# Altium schematic sheet 超声波传感器.SchDoc
size A4
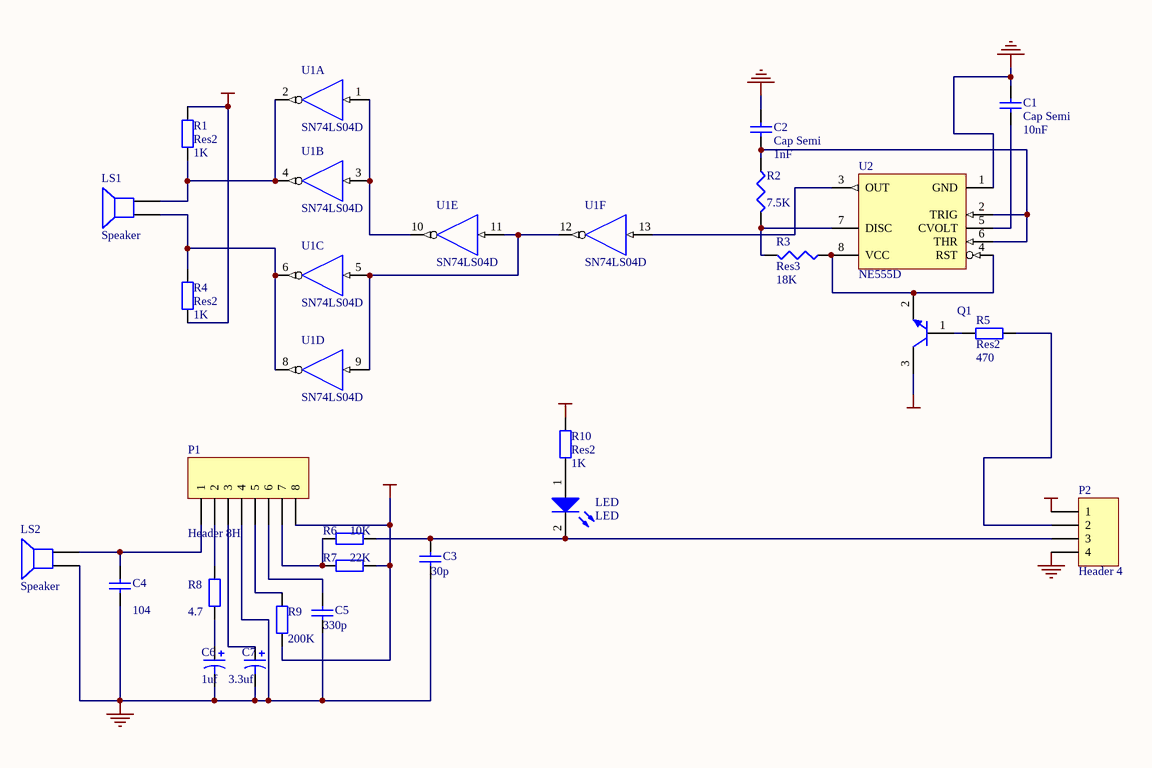
[diagram p0: 超声波传感器.SchDoc]

## Parts
C1  Cap Semi  value 10nF  [CPDR]
C2  Cap Semi  value 1nF  [CPDR]
C3  value 30p  [CPDR]  (hidden comment: Cap Semi)
C4  value 104  [CPDR]  (hidden comment: Cap Semi)
C5  value 330p  [CPDR]  (hidden comment: Cap Semi)
C6  value 1uf  [C-DJ-4]  (hidden comment: Cap Pol3)
C7  value 3.3uf  [C-DJ-4]  (hidden comment: Cap Pol3)
LED  LED  [CPDR]
LS1  Speaker  [CSB]
LS2  Speaker  [CSB]
P1  Header 8H  [HDR-8]
P2  Header 4  [HDR1X4]
Q1  (no value)  [BCY-W3/E4]
R1  Res2  value 1K  [RSE]
R2  value 7.5K  [RSE]  (hidden comment: Res3)
R3  Res3  value 18K  [RSE]
R4  Res2  value 1K  [RSE]
R5  Res2  value 470  [RSE]
R6  value 10K  [RSE]  (hidden comment: Res2)
R7  value 22K  [RSE]  (hidden comment: Res2)
R8  value 4.7  [RSE]  (hidden comment: Res2)
R9  value 200K  [RSE]  (hidden comment: Res2)
R10  Res2  value 1K  [RSE]
U1  SN74LS04D  [DIP14]  (parts A,B,C,D,E,F of 6)
U2  NE555D  [DIP8]

## Nets
GND: C1.1 C2.1 C3.2 C4.2 C5.2 C6.2 C7.2 LS2.1 P1.4 P2.4 U1.7(GND) U2.1(GND)
VCC: P1.8 P2.1 Q1.3(C) R1.2 R4.1 R7.2 R9.1 R10.2 U1.14(VCC)
NetC1_2: C1.2 U2.5(CVOLT)
NetC2_2: C2.2 R2.1 U2.2(TRIG) U2.6(THR)
NetC3_1: C3.1 LED.2(K) P2.3 R6.1
NetC4_1: C4.1 LS2.2 P1.1
NetC5_1: C5.1 P1.6
NetC6_1: C6.1 R8.1
NetC7_1: C7.1 P1.3
NetLED_1: LED.1(A) R10.1
NetLS1_1: LS1.1 R4.2 U1.6(Y) U1.8(Y)
NetLS1_2: LS1.2 R1.1 U1.2(Y) U1.4(Y)
NetP1_2: P1.2 R8.2
NetP1_5: P1.5 R9.2
NetP1_7: P1.7 R6.2 R7.1
NetP2_2: P2.2 R5.2
NetQ1_1: Q1.1(B) R5.1
NetQ1_2: Q1.2(E) R3.1 U2.4(RST) U2.8(VCC)
NetR2_2: R2.2 R3.2 U2.7(DISC)
NetU1_1: U1.1(A) U1.3(A) U1.10(Y)
NetU1_5: U1.5(A) U1.9(A) U1.11(A) U1.12(Y)
NetU1_13: U1.13(A) U2.3(OUT)

## Library data of the parts
C1-C5 = Cap Semi: Capacitor (Semiconductor SIM Model); Published: 8-Jun-2000; LatestRevisionDate: 17-Jul-2002; LatestRevisionNote: Re-released for DXP Platform.; PackageReference: C1206; Publisher: Altium Limited
C6 C7 = Cap Pol3: Polarized Capacitor (Surface Mount); Published: 8-Jun-2000; LatestRevisionDate: 17-Jul-2002; LatestRevisionNote: Re-released for DXP Platform.; PackageReference: C0805; Publisher: Altium Limited
LED = LED: 发光二极管; Published: 8-Jun-2000; LatestRevisionDate: 17-Jul-2002; LatestRevisionNote: Re-released for DXP Platform.; Publisher: Altium Limited
LS1 LS2 = Speaker: Loudspeaker; Published: 24-Mar-1999; LatestRevisionDate: 17-Jul-2002; LatestRevisionNote: Re-released for DXP Platform.; PackageReference: PIN2; Publisher: Altium Limited
P1 = Header 8H: Header, 8-Pin, Right Angle; LatestRevisionDate: 17-Jul-2002; LatestRevisionNote: Re-released for DXP Platform.; Publisher: Altium Limited
P2 = Header 4: Header, 4-Pin; LatestRevisionDate: 17-Jul-2002; LatestRevisionNote: Re-released for DXP Platform.; Publisher: Altium Limited
Q1 = TPSJG_NPN: 贴片三极管——NPN; Published: 8-Jun-2000; LatestRevisionDate: 15-Jan-2003; LatestRevisionNote: PCB Footprint 'BCY-W3/D4.7' replaced; DatasheetDocument: 1997; PackageReference: TO-92A; Publisher: Altium Limited; Code_JEDEC: TO-92A
R1 R4-R10 = Res2: Resistor; Published: 8-Jun-2000; LatestRevisionDate: 17-Jul-2002; LatestRevisionNote: Re-released for DXP Platform.; PackageReference: AXIAL-0.4; Publisher: Altium Limited
R2 R3 = Res3: Resistor; Published: 8-Jun-2000; LatestRevisionDate: 04-Mar-2005; LatestRevisionNote: PCB Footprint replaced.; PackageReference: J1-0603; Publisher: Altium Limited
U1 = SN74LS04D: Hex Inverter; Published: 8-Jun-2000; LatestRevisionDate: 4-Mar-2005; LatestRevisionNote: Stylized 3D Model Added.; DatasheetDocument: Mar-1988; PackageDocument: Jan-1998; PackageReference: D014; Publisher: Altium Limited; ComponentLink1Description: Manufacturer Link; ComponentLink1URL: http://www.ti.com/; ComponentLink2Description: Datasheet; ComponentLink2URL: http://www-s.ti.com/sc/ds/sn74ls04.pdf
U2 = NE555D: Precision Timer; Published: 16-Jan-2001; LatestRevisionDate: 04-Mar-2005; LatestRevisionNote: Stylized 3D Model Added.; DatasheetDocument: Feb-1992; PackageDocument: Jan-1998; PackageReference: D008; Publisher: Altium Limited; ComponentLink1Description: Manufacturer Link; ComponentLink1URL: http://www.ti.com/; ComponentLink2Description: Datasheet; ComponentLink2URL: http://www-s.ti.com/sc/ds/ne555.pdf